# EAGLE board 00A-83 (EAGLE 6.3), part 1 of 2
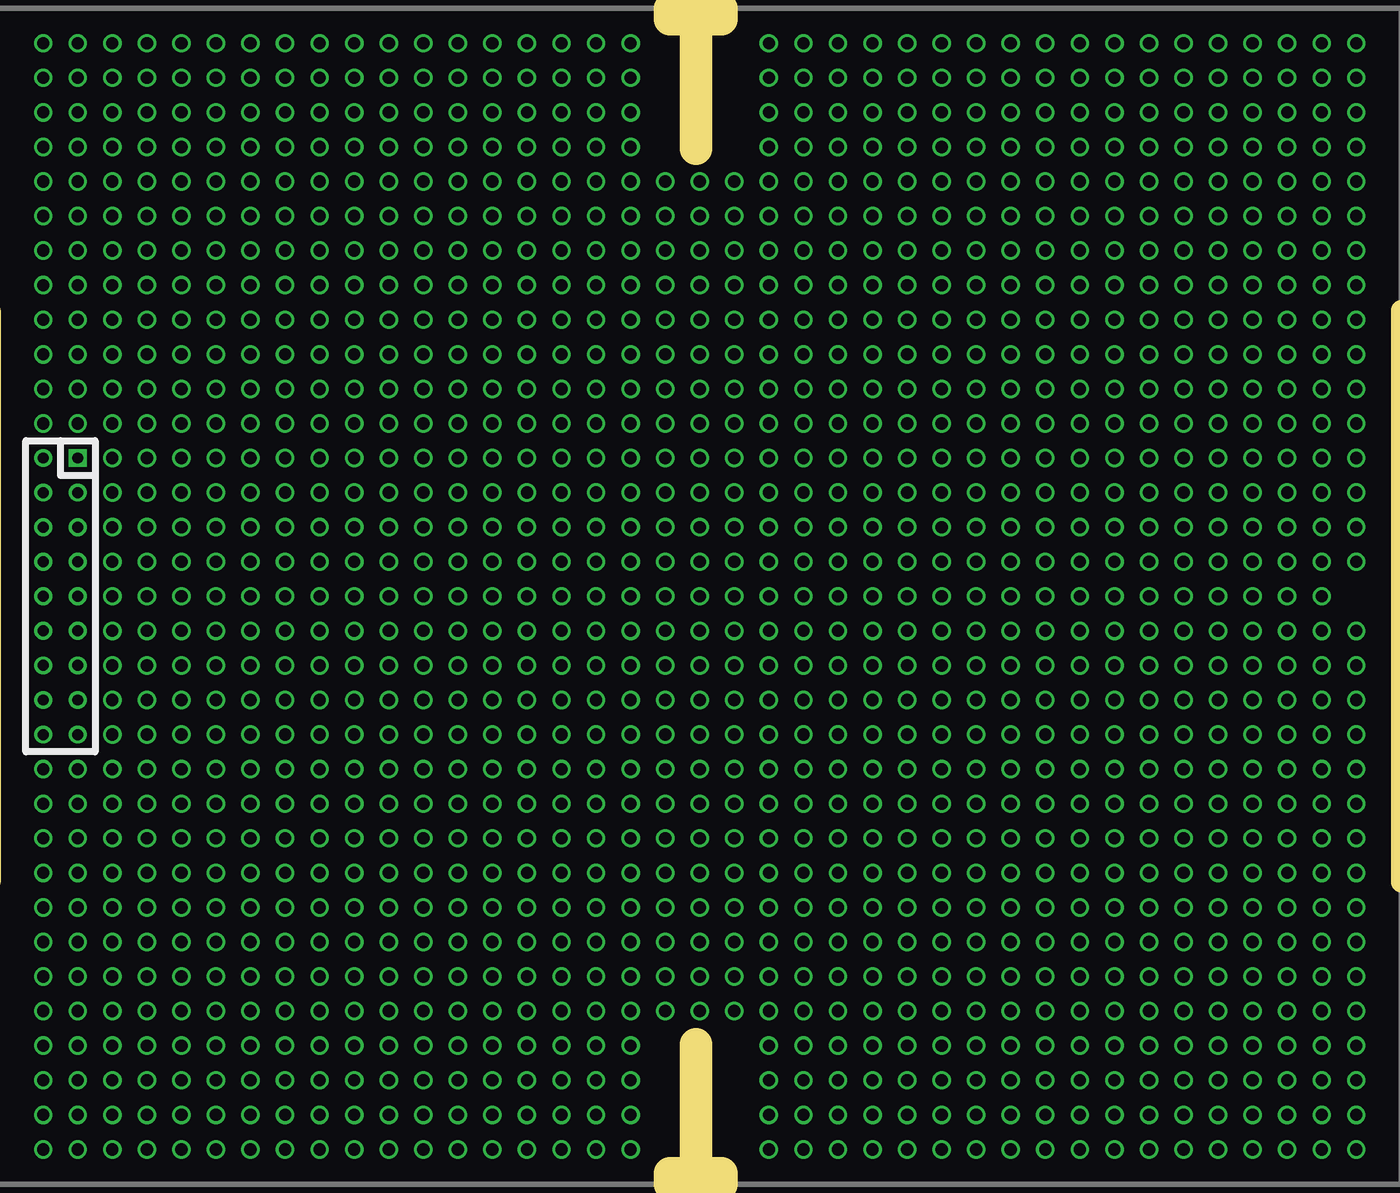
[diagram p1: board, top side]

No outline drawn. Coordinates in mm, seen from the top.
Copper layers (1*16): Top 0.035mm / dielectric 1.5mm / Bottom 0.035mm
Design rules "default": minimum track width 10mil, minimum drill 0.6mm, track to track 8mil, track to pad 8mil, pad to pad 8mil, via to via 8mil, smd to smd 8mil, copper to edge 40mil, drill to drill 8mil, minimum pad ring 10mil, minimum via ring 8mil, stop-mask expansion 4mil, vias tented up to drill 0mil, thermal gap 10mil

## Footprints (pad centres in the part's own frame; a part is rotated, then mirrored left to right if it is on the bottom)
BC_HOUSING_107MM = drill 0.8 square: 1 6.42,10.16 | drill 0.8: 2 3.88,10.16; 3 6.42,7.62; 4 3.88,7.62; 5 6.42,5.08; 6 3.88,5.08; 7 6.42,2.54; 8 3.88,2.54; 9 6.42,0; 10 3.88,0; 11 6.42,-2.54; 12 3.88,-2.54; 13 6.42,-5.08; 14 3.88,-5.08; 15A 6.42,-7.62; 15B 3.88,-7.62; 16A 6.42,-10.16; 16B 3.88,-10.16

## Placement (x,y rotation side)
J1  [BC_HOUSING_107MM]  -3.88,-10.16 0 top

## Tracks (layer width: path | path; a pad name or v marks a point on that pad's centre or on a via)
N$1  (via drill 0.9)
  other vias: 0,2.54
N$2  (via drill 0.9)
  other vias: 2.54,2.54
N$3  (via drill 0.9)
  other vias: 2.54,5.08
N$4  (via drill 0.9)
  other vias: 0,5.08
N$5  (via drill 0.9)
  other vias: 0,7.62
N$6  (via drill 0.9)
  other vias: 2.54,7.62
N$7  (via drill 0.9)
  other vias: 0,10.16
N$8  (via drill 0.9)
  other vias: 2.54,10.16
N$9  (via drill 0.9)
  other vias: 0,12.7
N$10  (via drill 0.9)
  other vias: 2.54,12.7
N$11  (via drill 0.9)
  other vias: 0,15.24
N$12  (via drill 0.9)
  other vias: 2.54,15.24
N$13  (via drill 0.9)
  other vias: 0,17.78
N$14  (via drill 0.9)
  other vias: 2.54,17.78
N$15  (via drill 0.9)
  other vias: 0,20.32
N$16  (via drill 0.9)
  other vias: 2.54,20.32
N$17  (via drill 0.9)
  other vias: 0,22.86
N$18  (via drill 0.9)
  other vias: 2.54,22.86
N$19  (via drill 0.9)
  other vias: 0,25.4
N$20  (via drill 0.9)
  other vias: 2.54,25.4
N$21  (via drill 0.9)
  other vias: 0,27.94
N$22  (via drill 0.9)
  other vias: 2.54,27.94
N$23  (via drill 0.9)
  other vias: 0,30.48
N$24  (via drill 0.9)
  other vias: 2.54,30.48
N$25  (via drill 0.9)
  other vias: 0,-50.8
N$26  (via drill 0.9)
  other vias: 2.54,-50.8
N$27  (via drill 0.9)
  other vias: 2.54,-48.26
N$28  (via drill 0.9)
  other vias: 0,-48.26
N$29  (via drill 0.9)
  other vias: 0,-45.72
N$30  (via drill 0.9)
  other vias: 2.54,-45.72
N$31  (via drill 0.9)
  other vias: 0,-43.18
N$32  (via drill 0.9)
  other vias: 2.54,-43.18
N$33  (via drill 0.9)
  other vias: 0,-40.64
N$34  (via drill 0.9)
  other vias: 2.54,-40.64
N$35  (via drill 0.9)
  other vias: 0,-38.1
N$36  (via drill 0.9)
  other vias: 2.54,-38.1
N$37  (via drill 0.9)
  other vias: 0,-35.56
N$38  (via drill 0.9)
  other vias: 2.54,-35.56
N$39  (via drill 0.9)
  other vias: 0,-33.02
N$40  (via drill 0.9)
  other vias: 2.54,-33.02
N$41  (via drill 0.9)
  other vias: 0,-30.48
N$42  (via drill 0.9)
  other vias: 2.54,-30.48
N$43  (via drill 0.9)
  other vias: 0,-27.94
N$44  (via drill 0.9)
  other vias: 2.54,-27.94
N$45  (via drill 0.9)
  other vias: 0,-25.4
N$46  (via drill 0.9)
  other vias: 2.54,-25.4
N$47  (via drill 0.9)
  other vias: 0,-22.86
N$48  (via drill 0.9)
  other vias: 2.54,-22.86
N$49  (via drill 0.9)
  other vias: 5.08,2.54
N$50  (via drill 0.9)
  other vias: 7.62,2.54
N$51  (via drill 0.9)
  other vias: 7.62,5.08
N$52  (via drill 0.9)
  other vias: 5.08,5.08
N$53  (via drill 0.9)
  other vias: 5.08,7.62
N$54  (via drill 0.9)
  other vias: 7.62,7.62
N$55  (via drill 0.9)
  other vias: 5.08,10.16
N$56  (via drill 0.9)
  other vias: 7.62,10.16
N$57  (via drill 0.9)
  other vias: 5.08,12.7
N$58  (via drill 0.9)
  other vias: 7.62,12.7
N$59  (via drill 0.9)
  other vias: 5.08,15.24
N$60  (via drill 0.9)
  other vias: 7.62,15.24
N$61  (via drill 0.9)
  other vias: 5.08,17.78
N$62  (via drill 0.9)
  other vias: 7.62,17.78
N$63  (via drill 0.9)
  other vias: 5.08,20.32
N$64  (via drill 0.9)
  other vias: 7.62,20.32
N$65  (via drill 0.9)
  other vias: 5.08,22.86
N$66  (via drill 0.9)
  other vias: 7.62,22.86
N$67  (via drill 0.9)
  other vias: 5.08,25.4
N$68  (via drill 0.9)
  other vias: 7.62,25.4
N$69  (via drill 0.9)
  other vias: 5.08,27.94
N$70  (via drill 0.9)
  other vias: 7.62,27.94
N$71  (via drill 0.9)
  other vias: 5.08,30.48
N$72  (via drill 0.9)
  other vias: 7.62,30.48
N$73  (via drill 0.9)
  other vias: 5.08,-27.94
N$74  (via drill 0.9)
  other vias: 7.62,-27.94
N$75  (via drill 0.9)
  other vias: 7.62,-25.4
N$76  (via drill 0.9)
  other vias: 5.08,-25.4
N$77  (via drill 0.9)
  other vias: 5.08,-22.86
N$78  (via drill 0.9)
  other vias: 7.62,-22.86
N$79  (via drill 0.9)
  other vias: 5.08,-20.32
N$80  (via drill 0.9)
  other vias: 7.62,-20.32
N$81  (via drill 0.9)
  other vias: 5.08,-17.78
N$82  (via drill 0.9)
  other vias: 7.62,-17.78
N$83  (via drill 0.9)
  other vias: 5.08,-15.24
N$84  (via drill 0.9)
  other vias: 7.62,-15.24
N$85  (via drill 0.9)
  other vias: 5.08,-12.7
N$86  (via drill 0.9)
  other vias: 7.62,-12.7
N$87  (via drill 0.9)
  other vias: 5.08,-10.16
N$88  (via drill 0.9)
  other vias: 7.62,-10.16
N$89  (via drill 0.9)
  other vias: 5.08,-7.62
N$90  (via drill 0.9)
  other vias: 7.62,-7.62
N$91  (via drill 0.9)
  other vias: 5.08,-5.08
N$92  (via drill 0.9)
  other vias: 7.62,-5.08
N$93  (via drill 0.9)
  other vias: 5.08,-2.54
N$94  (via drill 0.9)
  other vias: 7.62,-2.54
N$95  (via drill 0.9)
  other vias: 5.08,0
N$96  (via drill 0.9)
  other vias: 7.62,0
N$97  (via drill 0.9)
  other vias: 45.72,2.54
N$98  (via drill 0.9)
  other vias: 45.72,5.08
N$99  (via drill 0.9)
  other vias: 45.72,7.62
N$100  (via drill 0.9)
  other vias: 45.72,10.16
N$101  (via drill 0.9)
  other vias: 45.72,12.7
N$102  (via drill 0.9)
  other vias: 45.72,15.24
N$103  (via drill 0.9)
  other vias: 5.08,-50.8
N$104  (via drill 0.9)
  other vias: 7.62,-50.8
N$105  (via drill 0.9)
  other vias: 5.08,-48.26
N$106  (via drill 0.9)
  other vias: 7.62,-48.26
N$107  (via drill 0.9)
  other vias: 5.08,-45.72
N$108  (via drill 0.9)
  other vias: 7.62,-45.72
N$109  (via drill 0.9)
  other vias: 5.08,-43.18
N$110  (via drill 0.9)
  other vias: 7.62,-43.18
N$111  (via drill 0.9)
  other vias: 5.08,-40.64
N$112  (via drill 0.9)
  other vias: 7.62,-40.64
N$113  (via drill 0.9)
  other vias: 5.08,-38.1
N$114  (via drill 0.9)
  other vias: 7.62,-38.1
N$115  (via drill 0.9)
  other vias: 5.08,-35.56
N$116  (via drill 0.9)
  other vias: 7.62,-35.56
N$117  (via drill 0.9)
  other vias: 5.08,-33.02
N$118  (via drill 0.9)
  other vias: 7.62,-33.02
N$119  (via drill 0.9)
  other vias: 5.08,-30.48
N$120  (via drill 0.9)
  other vias: 7.62,-30.48
N$121  (via drill 0.9)
  other vias: 10.16,2.54
N$122  (via drill 0.9)
  other vias: 12.7,2.54
N$123  (via drill 0.9)
  other vias: 12.7,5.08
N$124  (via drill 0.9)
  other vias: 10.16,5.08
N$125  (via drill 0.9)
  other vias: 10.16,7.62
N$126  (via drill 0.9)
  other vias: 12.7,7.62
N$127  (via drill 0.9)
  other vias: 10.16,10.16
N$128  (via drill 0.9)
  other vias: 12.7,10.16
N$129  (via drill 0.9)
  other vias: 10.16,12.7
N$130  (via drill 0.9)
  other vias: 12.7,12.7
N$131  (via drill 0.9)
  other vias: 10.16,15.24
N$132  (via drill 0.9)
  other vias: 12.7,15.24
N$133  (via drill 0.9)
  other vias: 10.16,17.78
N$134  (via drill 0.9)
  other vias: 12.7,17.78
N$135  (via drill 0.9)
  other vias: 10.16,20.32
N$136  (via drill 0.9)
  other vias: 12.7,20.32
N$137  (via drill 0.9)
  other vias: 10.16,22.86
N$138  (via drill 0.9)
  other vias: 12.7,22.86
N$139  (via drill 0.9)
  other vias: 10.16,25.4
N$140  (via drill 0.9)
  other vias: 12.7,25.4
N$141  (via drill 0.9)
  other vias: 10.16,27.94
N$142  (via drill 0.9)
  other vias: 12.7,27.94
N$143  (via drill 0.9)
  other vias: 10.16,30.48
N$144  (via drill 0.9)
  other vias: 12.7,30.48
N$145  (via drill 0.9)
  other vias: 10.16,-27.94
N$146  (via drill 0.9)
  other vias: 12.7,-27.94
N$147  (via drill 0.9)
  other vias: 12.7,-25.4
N$148  (via drill 0.9)
  other vias: 10.16,-25.4
N$149  (via drill 0.9)
  other vias: 10.16,-22.86
N$150  (via drill 0.9)
  other vias: 12.7,-22.86
N$151  (via drill 0.9)
  other vias: 10.16,-20.32
N$152  (via drill 0.9)
  other vias: 12.7,-20.32
N$153  (via drill 0.9)
  other vias: 10.16,-17.78
N$154  (via drill 0.9)
  other vias: 12.7,-17.78
N$155  (via drill 0.9)
  other vias: 10.16,-15.24
N$156  (via drill 0.9)
  other vias: 12.7,-15.24
N$157  (via drill 0.9)
  other vias: 10.16,-12.7
N$158  (via drill 0.9)
  other vias: 12.7,-12.7
N$159  (via drill 0.9)
  other vias: 10.16,-10.16
N$160  (via drill 0.9)
  other vias: 12.7,-10.16
N$161  (via drill 0.9)
  other vias: 10.16,-7.62
N$162  (via drill 0.9)
  other vias: 12.7,-7.62
N$163  (via drill 0.9)
  other vias: 10.16,-5.08
N$164  (via drill 0.9)
  other vias: 12.7,-5.08
N$165  (via drill 0.9)
  other vias: 10.16,-2.54
N$166  (via drill 0.9)
  other vias: 12.7,-2.54
N$167  (via drill 0.9)
  other vias: 10.16,0
N$168  (via drill 0.9)
  other vias: 12.7,0
N$169  (via drill 0.9)
  other vias: 10.16,-50.8
N$170  (via drill 0.9)
  other vias: 12.7,-50.8
N$171  (via drill 0.9)
  other vias: 10.16,-48.26
N$172  (via drill 0.9)
  other vias: 12.7,-48.26
N$173  (via drill 0.9)
  other vias: 10.16,-45.72
N$174  (via drill 0.9)
  other vias: 12.7,-45.72
N$175  (via drill 0.9)
  other vias: 10.16,-43.18
N$176  (via drill 0.9)
  other vias: 12.7,-43.18
N$177  (via drill 0.9)
  other vias: 10.16,-40.64
N$178  (via drill 0.9)
  other vias: 12.7,-40.64
N$179  (via drill 0.9)
  other vias: 10.16,-38.1
N$180  (via drill 0.9)
  other vias: 12.7,-38.1
N$181  (via drill 0.9)
  other vias: 10.16,-35.56
N$182  (via drill 0.9)
  other vias: 12.7,-35.56
N$183  (via drill 0.9)
  other vias: 10.16,-33.02
N$184  (via drill 0.9)
  other vias: 12.7,-33.02
N$185  (via drill 0.9)
  other vias: 10.16,-30.48
N$186  (via drill 0.9)
  other vias: 12.7,-30.48
N$187  (via drill 0.9)
  other vias: 15.24,2.54
N$188  (via drill 0.9)
  other vias: 17.78,2.54
N$189  (via drill 0.9)
  other vias: 17.78,5.08
N$190  (via drill 0.9)
  other vias: 15.24,5.08
N$191  (via drill 0.9)
  other vias: 15.24,7.62
N$192  (via drill 0.9)
  other vias: 17.78,7.62
N$193  (via drill 0.9)
  other vias: 15.24,10.16
N$194  (via drill 0.9)
  other vias: 17.78,10.16
N$195  (via drill 0.9)
  other vias: 15.24,12.7
N$196  (via drill 0.9)
  other vias: 17.78,12.7
N$197  (via drill 0.9)
  other vias: 15.24,15.24
N$198  (via drill 0.9)
  other vias: 17.78,15.24
N$199  (via drill 0.9)
  other vias: 15.24,17.78
N$200  (via drill 0.9)
  other vias: 17.78,17.78
N$201  (via drill 0.9)
  other vias: 15.24,20.32
N$202  (via drill 0.9)
  other vias: 17.78,20.32
N$203  (via drill 0.9)
  other vias: 15.24,22.86
N$204  (via drill 0.9)
  other vias: 17.78,22.86
N$205  (via drill 0.9)
  other vias: 15.24,25.4
N$206  (via drill 0.9)
  other vias: 17.78,25.4
N$207  (via drill 0.9)
  other vias: 15.24,27.94
N$208  (via drill 0.9)
  other vias: 17.78,27.94
N$209  (via drill 0.9)
  other vias: 15.24,30.48
N$210  (via drill 0.9)
  other vias: 17.78,30.48
N$211  (via drill 0.9)
  other vias: 15.24,-27.94
N$212  (via drill 0.9)
  other vias: 17.78,-27.94
N$213  (via drill 0.9)
  other vias: 17.78,-25.4
N$214  (via drill 0.9)
  other vias: 15.24,-25.4
N$215  (via drill 0.9)
  other vias: 15.24,-22.86
N$216  (via drill 0.9)
  other vias: 17.78,-22.86
N$217  (via drill 0.9)
  other vias: 15.24,-20.32
N$218  (via drill 0.9)
  other vias: 17.78,-20.32
N$219  (via drill 0.9)
  other vias: 15.24,-17.78
N$220  (via drill 0.9)
  other vias: 17.78,-17.78
N$221  (via drill 0.9)
  other vias: 15.24,-15.24
N$222  (via drill 0.9)
  other vias: 17.78,-15.24
N$223  (via drill 0.9)
  other vias: 15.24,-12.7
N$224  (via drill 0.9)
  other vias: 17.78,-12.7
N$225  (via drill 0.9)
  other vias: 15.24,-10.16
N$226  (via drill 0.9)
  other vias: 17.78,-10.16
N$227  (via drill 0.9)
  other vias: 15.24,-7.62
N$228  (via drill 0.9)
  other vias: 17.78,-7.62
N$229  (via drill 0.9)
  other vias: 15.24,-5.08
N$230  (via drill 0.9)
  other vias: 17.78,-5.08
N$231  (via drill 0.9)
  other vias: 15.24,-2.54
N$232  (via drill 0.9)
  other vias: 17.78,-2.54
N$233  (via drill 0.9)
  other vias: 15.24,0
N$234  (via drill 0.9)
  other vias: 17.78,0
N$235  (via drill 0.9)
  other vias: 15.24,-50.8
N$236  (via drill 0.9)
  other vias: 17.78,-50.8
N$237  (via drill 0.9)
  other vias: 15.24,-48.26
N$238  (via drill 0.9)
  other vias: 17.78,-48.26
N$239  (via drill 0.9)
  other vias: 15.24,-45.72
N$240  (via drill 0.9)
  other vias: 17.78,-45.72
N$241  (via drill 0.9)
  other vias: 15.24,-43.18
N$242  (via drill 0.9)
  other vias: 17.78,-43.18
N$243  (via drill 0.9)
  other vias: 15.24,-40.64
N$244  (via drill 0.9)
  other vias: 17.78,-40.64
N$245  (via drill 0.9)
  other vias: 15.24,-38.1
N$246  (via drill 0.9)
  other vias: 17.78,-38.1
N$247  (via drill 0.9)
  other vias: 15.24,-35.56
N$248  (via drill 0.9)
  other vias: 17.78,-35.56
N$249  (via drill 0.9)
  other vias: 15.24,-33.02
N$250  (via drill 0.9)
  other vias: 17.78,-33.02
N$251  (via drill 0.9)
  other vias: 15.24,-30.48
N$252  (via drill 0.9)
  other vias: 17.78,-30.48
N$253  (via drill 0.9)
  other vias: 20.32,2.54
N$254  (via drill 0.9)
  other vias: 22.86,2.54
N$255  (via drill 0.9)
  other vias: 22.86,5.08
N$256  (via drill 0.9)
  other vias: 20.32,5.08
N$257  (via drill 0.9)
  other vias: 20.32,7.62
N$258  (via drill 0.9)
  other vias: 22.86,7.62
N$259  (via drill 0.9)
  other vias: 20.32,10.16
N$260  (via drill 0.9)
  other vias: 22.86,10.16
N$261  (via drill 0.9)
  other vias: 20.32,12.7
N$262  (via drill 0.9)
  other vias: 22.86,12.7
N$263  (via drill 0.9)
  other vias: 20.32,15.24
N$264  (via drill 0.9)
  other vias: 22.86,15.24
N$265  (via drill 0.9)
  other vias: 20.32,17.78
N$266  (via drill 0.9)
  other vias: 22.86,17.78
N$267  (via drill 0.9)
  other vias: 20.32,20.32
N$268  (via drill 0.9)
  other vias: 22.86,20.32
N$269  (via drill 0.9)
  other vias: 20.32,22.86
N$270  (via drill 0.9)
  other vias: 22.86,22.86
N$271  (via drill 0.9)
  other vias: 20.32,25.4
N$272  (via drill 0.9)
  other vias: 22.86,25.4
N$273  (via drill 0.9)
  other vias: 20.32,27.94
N$274  (via drill 0.9)
  other vias: 22.86,27.94
N$275  (via drill 0.9)
  other vias: 20.32,30.48
N$276  (via drill 0.9)
  other vias: 22.86,30.48
N$277  (via drill 0.9)
  other vias: 20.32,-27.94
N$278  (via drill 0.9)
  other vias: 22.86,-27.94
N$279  (via drill 0.9)
  other vias: 22.86,-25.4
N$280  (via drill 0.9)
  other vias: 20.32,-25.4
N$281  (via drill 0.9)
  other vias: 20.32,-22.86
N$282  (via drill 0.9)
  other vias: 22.86,-22.86
N$283  (via drill 0.9)
  other vias: 20.32,-20.32
N$284  (via drill 0.9)
  other vias: 22.86,-20.32
N$285  (via drill 0.9)
  other vias: 20.32,-17.78
N$286  (via drill 0.9)
  other vias: 22.86,-17.78
N$287  (via drill 0.9)
  other vias: 20.32,-15.24
N$288  (via drill 0.9)
  other vias: 22.86,-15.24
N$289  (via drill 0.9)
  other vias: 20.32,-12.7
N$290  (via drill 0.9)
  other vias: 22.86,-12.7
N$291  (via drill 0.9)
  other vias: 20.32,-10.16
N$292  (via drill 0.9)
  other vias: 22.86,-10.16
N$293  (via drill 0.9)
  other vias: 20.32,-7.62
N$294  (via drill 0.9)
  other vias: 22.86,-7.62
N$295  (via drill 0.9)
  other vias: 20.32,-5.08
N$296  (via drill 0.9)
  other vias: 22.86,-5.08
N$297  (via drill 0.9)
  other vias: 20.32,-2.54
N$298  (via drill 0.9)
  other vias: 22.86,-2.54
N$299  (via drill 0.9)
  other vias: 20.32,0
N$300  (via drill 0.9)
  other vias: 22.86,0
N$301  (via drill 0.9)
  other vias: 20.32,-50.8
N$302  (via drill 0.9)
  other vias: 22.86,-50.8
N$303  (via drill 0.9)
  other vias: 20.32,-48.26
N$304  (via drill 0.9)
  other vias: 22.86,-48.26
N$305  (via drill 0.9)
  other vias: 20.32,-45.72
N$306  (via drill 0.9)
  other vias: 22.86,-45.72
N$307  (via drill 0.9)
  other vias: 20.32,-43.18
N$308  (via drill 0.9)
  other vias: 22.86,-43.18
N$309  (via drill 0.9)
  other vias: 20.32,-40.64
N$310  (via drill 0.9)
  other vias: 22.86,-40.64
N$311  (via drill 0.9)
  other vias: 20.32,-38.1
N$312  (via drill 0.9)
  other vias: 22.86,-38.1
N$313  (via drill 0.9)
  other vias: 20.32,-35.56
N$314  (via drill 0.9)
  other vias: 22.86,-35.56
N$315  (via drill 0.9)
  other vias: 20.32,-33.02
N$316  (via drill 0.9)
  other vias: 22.86,-33.02
N$317  (via drill 0.9)
  other vias: 20.32,-30.48
N$318  (via drill 0.9)
  other vias: 22.86,-30.48
N$319  (via drill 0.9)
  other vias: 25.4,2.54
N$320  (via drill 0.9)
  other vias: 27.94,2.54
N$321  (via drill 0.9)
  other vias: 27.94,5.08
N$322  (via drill 0.9)
  other vias: 25.4,5.08
N$323  (via drill 0.9)
  other vias: 25.4,7.62
N$324  (via drill 0.9)
  other vias: 27.94,7.62
N$325  (via drill 0.9)
  other vias: 25.4,10.16
N$326  (via drill 0.9)
  other vias: 27.94,10.16
N$327  (via drill 0.9)
  other vias: 25.4,12.7
N$328  (via drill 0.9)
  other vias: 27.94,12.7
N$329  (via drill 0.9)
  other vias: 25.4,15.24
N$330  (via drill 0.9)
  other vias: 27.94,15.24
N$331  (via drill 0.9)
  other vias: 25.4,17.78
N$332  (via drill 0.9)
  other vias: 27.94,17.78
N$333  (via drill 0.9)
  other vias: 25.4,20.32
N$334  (via drill 0.9)
  other vias: 27.94,20.32
N$335  (via drill 0.9)
  other vias: 25.4,22.86
N$336  (via drill 0.9)
  other vias: 63.5,2.54
N$337  (via drill 0.9)
  other vias: 25.4,25.4
N$338  (via drill 0.9)
  other vias: 66.04,2.54
N$339  (via drill 0.9)
  other vias: 25.4,27.94
N$340  (via drill 0.9)
  other vias: 66.04,5.08
N$341  (via drill 0.9)
  other vias: 25.4,30.48
N$342  (via drill 0.9)
  other vias: 63.5,5.08
N$343  (via drill 0.9)
  other vias: 25.4,-27.94
N$344  (via drill 0.9)
  other vias: 27.94,-27.94
N$345  (via drill 0.9)
  other vias: 27.94,-25.4
N$346  (via drill 0.9)
  other vias: 25.4,-25.4
N$347  (via drill 0.9)
  other vias: 25.4,-22.86
N$348  (via drill 0.9)
  other vias: 27.94,-22.86
N$349  (via drill 0.9)
  other vias: 25.4,-20.32
N$350  (via drill 0.9)
  other vias: 27.94,-20.32
N$351  (via drill 0.9)
  other vias: 25.4,-17.78
N$352  (via drill 0.9)
  other vias: 27.94,-17.78
N$353  (via drill 0.9)
  other vias: 25.4,-15.24
N$354  (via drill 0.9)
  other vias: 27.94,-15.24
N$355  (via drill 0.9)
  other vias: 25.4,-12.7
N$356  (via drill 0.9)
  other vias: 27.94,-12.7
N$357  (via drill 0.9)
  other vias: 25.4,-10.16
N$358  (via drill 0.9)
  other vias: 27.94,-10.16
N$359  (via drill 0.9)
  other vias: 25.4,-7.62
N$360  (via drill 0.9)
  other vias: 27.94,-7.62
N$361  (via drill 0.9)
  other vias: 25.4,-5.08
N$362  (via drill 0.9)
  other vias: 27.94,-5.08
N$363  (via drill 0.9)
  other vias: 25.4,-2.54
N$364  (via drill 0.9)
  other vias: 27.94,-2.54
N$365  (via drill 0.9)
  other vias: 25.4,0
N$366  (via drill 0.9)
  other vias: 27.94,0
N$367  (via drill 0.9)
  other vias: 25.4,-50.8
N$368  (via drill 0.9)
  other vias: 63.5,7.62
N$369  (via drill 0.9)
  other vias: 25.4,-48.26
N$370  (via drill 0.9)
  other vias: 66.04,7.62
N$371  (via drill 0.9)
  other vias: 25.4,-45.72
N$372  (via drill 0.9)
  other vias: 63.5,10.16
N$373  (via drill 0.9)
  other vias: 25.4,-43.18
N$374  (via drill 0.9)
  other vias: 66.04,10.16
N$375  (via drill 0.9)
  other vias: 25.4,-40.64
N$376  (via drill 0.9)
  other vias: 27.94,-40.64
N$377  (via drill 0.9)
  other vias: 25.4,-38.1
N$378  (via drill 0.9)
  other vias: 27.94,-38.1
N$379  (via drill 0.9)
  other vias: 25.4,-35.56
N$380  (via drill 0.9)
  other vias: 27.94,-35.56
N$381  (via drill 0.9)
  other vias: 25.4,-33.02
N$382  (via drill 0.9)
  other vias: 27.94,-33.02
N$383  (via drill 0.9)
  other vias: 25.4,-30.48
N$384  (via drill 0.9)
  other vias: 27.94,-30.48
N$385  (via drill 0.9)
  other vias: 30.48,2.54
N$386  (via drill 0.9)
  other vias: 33.02,2.54
N$387  (via drill 0.9)
  other vias: 33.02,5.08
N$388  (via drill 0.9)
  other vias: 30.48,5.08
N$389  (via drill 0.9)
  other vias: 30.48,7.62
N$390  (via drill 0.9)
  other vias: 33.02,7.62
N$391  (via drill 0.9)
  other vias: 30.48,10.16
N$392  (via drill 0.9)
  other vias: 33.02,10.16
N$393  (via drill 0.9)
  other vias: 30.48,12.7
N$394  (via drill 0.9)
  other vias: 33.02,12.7
N$395  (via drill 0.9)
  other vias: 30.48,15.24
N$396  (via drill 0.9)
  other vias: 33.02,15.24
N$397  (via drill 0.9)
  other vias: 30.48,17.78
N$398  (via drill 0.9)
  other vias: 33.02,17.78
N$399  (via drill 0.9)
  other vias: 30.48,20.32
N$400  (via drill 0.9)
  other vias: 33.02,20.32
N$401  (via drill 0.9)
  other vias: 63.5,12.7
N$402  (via drill 0.9)
  other vias: 66.04,12.7
N$403  (via drill 0.9)
  other vias: 63.5,15.24
N$404  (via drill 0.9)
  other vias: 66.04,15.24
N$405  (via drill 0.9)
  other vias: 63.5,17.78
N$406  (via drill 0.9)
  other vias: 66.04,17.78
N$407  (via drill 0.9)
  other vias: 63.5,20.32
N$408  (via drill 0.9)
  other vias: 66.04,20.32
N$409  (via drill 0.9)
  other vias: 30.48,-27.94
N$410  (via drill 0.9)
  other vias: 33.02,-27.94
N$411  (via drill 0.9)
  other vias: 33.02,-25.4
N$412  (via drill 0.9)
  other vias: 30.48,-25.4
N$413  (via drill 0.9)
  other vias: 30.48,-22.86
N$414  (via drill 0.9)
  other vias: 33.02,-22.86
N$415  (via drill 0.9)
  other vias: 30.48,-20.32
N$416  (via drill 0.9)
  other vias: 33.02,-20.32
N$417  (via drill 0.9)
  other vias: 30.48,-17.78
N$418  (via drill 0.9)
  other vias: 33.02,-17.78
N$419  (via drill 0.9)
  other vias: 30.48,-15.24
N$420  (via drill 0.9)
  other vias: 33.02,-15.24
N$421  (via drill 0.9)
  other vias: 30.48,-12.7
N$422  (via drill 0.9)
  other vias: 33.02,-12.7
N$423  (via drill 0.9)
  other vias: 30.48,-10.16
N$424  (via drill 0.9)
  other vias: 33.02,-10.16
N$425  (via drill 0.9)
  other vias: 30.48,-7.62
N$426  (via drill 0.9)
  other vias: 33.02,-7.62
N$427  (via drill 0.9)
  other vias: 30.48,-5.08
N$428  (via drill 0.9)
  other vias: 33.02,-5.08
N$429  (via drill 0.9)
  other vias: 30.48,-2.54
N$430  (via drill 0.9)
  other vias: 33.02,-2.54
N$431  (via drill 0.9)
  other vias: 30.48,0
N$432  (via drill 0.9)
  other vias: 33.02,0
N$433  (via drill 0.9)
  other vias: 63.5,22.86
N$434  (via drill 0.9)
  other vias: 66.04,22.86
N$435  (via drill 0.9)
  other vias: 63.5,25.4
N$436  (via drill 0.9)
  other vias: 66.04,25.4
N$437  (via drill 0.9)
  other vias: 63.5,27.94
N$438  (via drill 0.9)
  other vias: 66.04,27.94
N$439  (via drill 0.9)
  other vias: 63.5,30.48
N$440  (via drill 0.9)
  other vias: 66.04,30.48
N$441  (via drill 0.9)
  other vias: 30.48,-40.64
N$442  (via drill 0.9)
  other vias: 33.02,-40.64
N$443  (via drill 0.9)
  other vias: 30.48,-38.1
N$444  (via drill 0.9)
  other vias: 33.02,-38.1
N$445  (via drill 0.9)
  other vias: 30.48,-35.56
N$446  (via drill 0.9)
  other vias: 33.02,-35.56
N$447  (via drill 0.9)
  other vias: 30.48,-33.02
N$448  (via drill 0.9)
  other vias: 33.02,-33.02
N$449  (via drill 0.9)
  other vias: 30.48,-30.48
N$450  (via drill 0.9)
  other vias: 33.02,-30.48
N$451  (via drill 0.9)
  other vias: 35.56,2.54
N$452  (via drill 0.9)
  other vias: 38.1,2.54
N$453  (via drill 0.9)
  other vias: 38.1,5.08
N$454  (via drill 0.9)
  other vias: 35.56,5.08
N$455  (via drill 0.9)
  other vias: 35.56,7.62
N$456  (via drill 0.9)
  other vias: 38.1,7.62
N$457  (via drill 0.9)
  other vias: 35.56,10.16
N$458  (via drill 0.9)
  other vias: 38.1,10.16
N$459  (via drill 0.9)
  other vias: 35.56,12.7
N$460  (via drill 0.9)
  other vias: 38.1,12.7
N$461  (via drill 0.9)
  other vias: 35.56,15.24
N$462  (via drill 0.9)
  other vias: 38.1,15.24
N$463  (via drill 0.9)
  other vias: 35.56,17.78
N$464  (via drill 0.9)
  other vias: 38.1,17.78
N$465  (via drill 0.9)
  other vias: 35.56,20.32
N$466  (via drill 0.9)
  other vias: 38.1,20.32
N$467  (via drill 0.9)
  other vias: 35.56,22.86
N$468  (via drill 0.9)
  other vias: 38.1,22.86
N$469  (via drill 0.9)
  other vias: 35.56,25.4
N$470  (via drill 0.9)
  other vias: 38.1,25.4
N$471  (via drill 0.9)
  other vias: 35.56,27.94
N$472  (via drill 0.9)
  other vias: 38.1,27.94
N$473  (via drill 0.9)
  other vias: 35.56,30.48
N$474  (via drill 0.9)
  other vias: 38.1,30.48
N$475  (via drill 0.9)
  other vias: 35.56,-27.94
N$476  (via drill 0.9)
  other vias: 38.1,-27.94
N$477  (via drill 0.9)
  other vias: 38.1,-25.4
N$478  (via drill 0.9)
  other vias: 35.56,-25.4
N$479  (via drill 0.9)
  other vias: 35.56,-22.86
N$480  (via drill 0.9)
  other vias: 38.1,-22.86
N$481  (via drill 0.9)
  other vias: 35.56,-20.32
N$482  (via drill 0.9)
  other vias: 38.1,-20.32
N$483  (via drill 0.9)
  other vias: 35.56,-17.78
N$484  (via drill 0.9)
  other vias: 38.1,-17.78
N$485  (via drill 0.9)
  other vias: 35.56,-15.24
N$486  (via drill 0.9)
  other vias: 38.1,-15.24
N$487  (via drill 0.9)
  other vias: 35.56,-12.7
N$488  (via drill 0.9)
  other vias: 38.1,-12.7
N$489  (via drill 0.9)
  other vias: 35.56,-10.16
N$490  (via drill 0.9)
  other vias: 38.1,-10.16
N$491  (via drill 0.9)
  other vias: 35.56,-7.62
N$492  (via drill 0.9)
  other vias: 38.1,-7.62
N$493  (via drill 0.9)
  other vias: 35.56,-5.08
N$494  (via drill 0.9)
  other vias: 38.1,-5.08
N$495  (via drill 0.9)
  other vias: 35.56,-2.54
N$496  (via drill 0.9)
  other vias: 38.1,-2.54
N$497  (via drill 0.9)
  other vias: 35.56,0
N$498  (via drill 0.9)
  other vias: 38.1,0
N$499  (via drill 0.9)
  other vias: 35.56,-50.8
N$500  (via drill 0.9)
  other vias: 38.1,-50.8
N$501  (via drill 0.9)
  other vias: 35.56,-48.26
N$502  (via drill 0.9)
  other vias: 38.1,-48.26
N$503  (via drill 0.9)
  other vias: 35.56,-45.72
N$504  (via drill 0.9)
  other vias: 38.1,-45.72
N$505  (via drill 0.9)
  other vias: 35.56,-43.18
N$506  (via drill 0.9)
  other vias: 38.1,-43.18
N$507  (via drill 0.9)
  other vias: 35.56,-40.64
N$508  (via drill 0.9)
  other vias: 38.1,-40.64
N$509  (via drill 0.9)
  other vias: 35.56,-38.1
N$510  (via drill 0.9)
  other vias: 38.1,-38.1
N$511  (via drill 0.9)
  other vias: 35.56,-35.56
N$512  (via drill 0.9)
  other vias: 38.1,-35.56
N$513  (via drill 0.9)
  other vias: 35.56,-33.02
N$514  (via drill 0.9)
  other vias: 38.1,-33.02
N$515  (via drill 0.9)
  other vias: 35.56,-30.48
N$516  (via drill 0.9)
  other vias: 38.1,-30.48
N$517  (via drill 0.9)
  other vias: 40.64,2.54
N$518  (via drill 0.9)
  other vias: 43.18,2.54
N$519  (via drill 0.9)
  other vias: 43.18,5.08
N$520  (via drill 0.9)
  other vias: 40.64,5.08
N$521  (via drill 0.9)
  other vias: 40.64,7.62
N$522  (via drill 0.9)
  other vias: 43.18,7.62
N$523  (via drill 0.9)
  other vias: 40.64,10.16
N$524  (via drill 0.9)
  other vias: 43.18,10.16
N$525  (via drill 0.9)
  other vias: 40.64,12.7
N$526  (via drill 0.9)
  other vias: 43.18,12.7
N$527  (via drill 0.9)
  other vias: 40.64,15.24
N$528  (via drill 0.9)
  other vias: 43.18,15.24
N$529  (via drill 0.9)
  other vias: 40.64,17.78
N$530  (via drill 0.9)
  other vias: 43.18,17.78
N$531  (via drill 0.9)
  other vias: 40.64,20.32
N$532  (via drill 0.9)
  other vias: 43.18,20.32
N$533  (via drill 0.9)
  other vias: 40.64,22.86
N$534  (via drill 0.9)
  other vias: 43.18,22.86
N$535  (via drill 0.9)
  other vias: 40.64,25.4
N$536  (via drill 0.9)
  other vias: 43.18,25.4
N$537  (via drill 0.9)
  other vias: 40.64,27.94
N$538  (via drill 0.9)
  other vias: 43.18,27.94
N$539  (via drill 0.9)
  other vias: 40.64,30.48
N$540  (via drill 0.9)
  other vias: 43.18,30.48
N$541  (via drill 0.9)
  other vias: 40.64,-27.94
N$542  (via drill 0.9)
  other vias: 43.18,-27.94
N$543  (via drill 0.9)
  other vias: 43.18,-25.4
N$544  (via drill 0.9)
  other vias: 40.64,-25.4
N$545  (via drill 0.9)
  other vias: 40.64,-22.86
N$546  (via drill 0.9)
  other vias: 43.18,-22.86
N$547  (via drill 0.9)
  other vias: 40.64,-20.32
N$548  (via drill 0.9)
  other vias: 43.18,-20.32
N$549  (via drill 0.9)
  other vias: 40.64,-17.78
N$550  (via drill 0.9)
  other vias: 43.18,-17.78
N$551  (via drill 0.9)
  other vias: 40.64,-15.24
N$552  (via drill 0.9)
  other vias: 43.18,-15.24
N$553  (via drill 0.9)
  other vias: 40.64,-12.7
N$554  (via drill 0.9)
  other vias: 43.18,-12.7
N$555  (via drill 0.9)
  other vias: 40.64,-10.16 43.18,-10.16
N$556  (via drill 0.9)
  other vias: 45.72,17.78
N$557  (via drill 0.9)
  other vias: 40.64,-7.62
N$558  (via drill 0.9)
  other vias: 43.18,-7.62
N$559  (via drill 0.9)
  other vias: 40.64,-5.08
N$560  (via drill 0.9)
  other vias: 43.18,-5.08
N$561  (via drill 0.9)
  other vias: 40.64,-2.54
N$562  (via drill 0.9)
  other vias: 43.18,-2.54
N$563  (via drill 0.9)
  other vias: 40.64,0
N$564  (via drill 0.9)
  other vias: 43.18,0
N$565  (via drill 0.9)
  other vias: 40.64,-50.8
N$566  (via drill 0.9)
  other vias: 43.18,-50.8
N$567  (via drill 0.9)
  other vias: 40.64,-48.26
N$568  (via drill 0.9)
  other vias: 43.18,-48.26
N$569  (via drill 0.9)
  other vias: 40.64,-45.72
N$570  (via drill 0.9)
  other vias: 43.18,-45.72
N$571  (via drill 0.9)
  other vias: 40.64,-43.18
N$572  (via drill 0.9)
  other vias: 43.18,-43.18
N$573  (via drill 0.9)
  other vias: 40.64,-40.64
N$574  (via drill 0.9)
  other vias: 43.18,-40.64
N$575  (via drill 0.9)
  other vias: 40.64,-38.1
N$576  (via drill 0.9)
  other vias: 43.18,-38.1
N$577  (via drill 0.9)
  other vias: 40.64,-35.56
N$578  (via drill 0.9)
  other vias: 43.18,-35.56
N$579  (via drill 0.9)
  other vias: 40.64,-33.02
N$580  (via drill 0.9)
  other vias: 43.18,-33.02
N$581  (via drill 0.9)
  other vias: 40.64,-30.48
N$582  (via drill 0.9)
  other vias: 43.18,-30.48
N$583  (via drill 0.9)
  other vias: 45.72,20.32
N$588  (via drill 0.9)
  other vias: 45.72,-27.94
N$589  (via drill 0.9)
  other vias: 45.72,-25.4
N$590  (via drill 0.9)
  other vias: 45.72,-22.86
N$591  (via drill 0.9)
  other vias: 45.72,-20.32
N$592  (via drill 0.9)
  other vias: 45.72,-17.78
N$593  (via drill 0.9)
  other vias: 45.72,-15.24
N$594  (via drill 0.9)
  other vias: 45.72,-12.7
N$595  (via drill 0.9)
  other vias: 45.72,-10.16
N$596  (via drill 0.9)
  other vias: 45.72,-7.62
N$597  (via drill 0.9)
  other vias: 45.72,-5.08
N$598  (via drill 0.9)
  other vias: 45.72,-2.54
N$599  (via drill 0.9)
  other vias: 45.72,0
N$604  (via drill 0.9)
  other vias: 45.72,-40.64
N$605  (via drill 0.9)
  other vias: 45.72,-38.1
N$606  (via drill 0.9)
  other vias: 45.72,-35.56
N$607  (via drill 0.9)
  other vias: 45.72,-33.02
N$608  (via drill 0.9)
  other vias: 45.72,-30.48
N$609  (via drill 0.9)
  other vias: 48.26,2.54
N$610  (via drill 0.9)
  other vias: 50.8,2.54
N$611  (via drill 0.9)
  other vias: 50.8,5.08
N$612  (via drill 0.9)
  other vias: 48.26,5.08
N$613  (via drill 0.9)
  other vias: 48.26,7.62
N$614  (via drill 0.9)
  other vias: 50.8,7.62
N$615  (via drill 0.9)
  other vias: 48.26,10.16
N$616  (via drill 0.9)
  other vias: 50.8,10.16
N$617  (via drill 0.9)
  other vias: 48.26,12.7
N$618  (via drill 0.9)
  other vias: 50.8,12.7
N$619  (via drill 0.9)
  other vias: 48.26,15.24
N$620  (via drill 0.9)
  other vias: 50.8,15.24
N$621  (via drill 0.9)
  other vias: 48.26,17.78
N$622  (via drill 0.9)
  other vias: 50.8,17.78
N$623  (via drill 0.9)
  other vias: 48.26,20.32
N$624  (via drill 0.9)
  other vias: 50.8,20.32
N$633  (via drill 0.9)
  other vias: 48.26,-27.94
N$634  (via drill 0.9)
  other vias: 50.8,-27.94
N$635  (via drill 0.9)
  other vias: 50.8,-25.4
N$636  (via drill 0.9)
  other vias: 48.26,-25.4
N$637  (via drill 0.9)
  other vias: 48.26,-22.86
N$638  (via drill 0.9)
  other vias: 50.8,-22.86
N$639  (via drill 0.9)
  other vias: 48.26,-20.32
N$640  (via drill 0.9)
  other vias: 50.8,-20.32
N$641  (via drill 0.9)
  other vias: 48.26,-17.78
N$642  (via drill 0.9)
  other vias: 50.8,-17.78
N$643  (via drill 0.9)
  other vias: 48.26,-15.24
N$644  (via drill 0.9)
  other vias: 50.8,-15.24
N$645  (via drill 0.9)
  other vias: 48.26,-12.7
N$646  (via drill 0.9)
  other vias: 50.8,-12.7
N$647  (via drill 0.9)
  other vias: 48.26,-10.16
N$648  (via drill 0.9)
  other vias: 50.8,-10.16
N$649  (via drill 0.9)
  other vias: 48.26,-7.62
N$650  (via drill 0.9)
  other vias: 50.8,-7.62
N$651  (via drill 0.9)
  other vias: 48.26,-5.08
N$652  (via drill 0.9)
  other vias: 50.8,-5.08
N$653  (via drill 0.9)
  other vias: 48.26,-2.54
N$654  (via drill 0.9)
  other vias: 50.8,-2.54
N$655  (via drill 0.9)
  other vias: 48.26,0
N$656  (via drill 0.9)
  other vias: 50.8,0
N$665  (via drill 0.9)
  other vias: 48.26,-40.64
N$666  (via drill 0.9)
  other vias: 50.8,-40.64
N$667  (via drill 0.9)
  other vias: 48.26,-38.1
N$668  (via drill 0.9)
  other vias: 50.8,-38.1
N$669  (via drill 0.9)
  other vias: 48.26,-35.56
N$670  (via drill 0.9)
  other vias: 50.8,-35.56
N$671  (via drill 0.9)
  other vias: 48.26,-33.02
N$672  (via drill 0.9)
  other vias: 50.8,-33.02
N$673  (via drill 0.9)
  other vias: 48.26,-30.48
N$674  (via drill 0.9)
  other vias: 50.8,-30.48
N$675  (via drill 0.9)
  other vias: 53.34,2.54
N$676  (via drill 0.9)
  other vias: 55.88,2.54
N$677  (via drill 0.9)
  other vias: 55.88,5.08
N$678  (via drill 0.9)
  other vias: 53.34,5.08
N$679  (via drill 0.9)
  other vias: 53.34,7.62
N$680  (via drill 0.9)
  other vias: 55.88,7.62
N$681  (via drill 0.9)
  other vias: 53.34,10.16
N$682  (via drill 0.9)
  other vias: 55.88,10.16
N$683  (via drill 0.9)
  other vias: 53.34,12.7
N$684  (via drill 0.9)
  other vias: 55.88,12.7
N$685  (via drill 0.9)
  other vias: 53.34,15.24
N$686  (via drill 0.9)
  other vias: 55.88,15.24
N$687  (via drill 0.9)
  other vias: 53.34,17.78
N$688  (via drill 0.9)
  other vias: 55.88,17.78
N$689  (via drill 0.9)
  other vias: 53.34,20.32
N$690  (via drill 0.9)
  other vias: 55.88,20.32
N$691  (via drill 0.9)
  other vias: 53.34,22.86
N$692  (via drill 0.9)
  other vias: 55.88,22.86
N$693  (via drill 0.9)
  other vias: 53.34,25.4
N$694  (via drill 0.9)
  other vias: 55.88,25.4
N$695  (via drill 0.9)
  other vias: 53.34,27.94
N$696  (via drill 0.9)
  other vias: 55.88,27.94
N$697  (via drill 0.9)
  other vias: 53.34,30.48
N$698  (via drill 0.9)
  other vias: 55.88,30.48
N$699  (via drill 0.9)
  other vias: 53.34,-27.94
N$700  (via drill 0.9)
  other vias: 55.88,-27.94
N$701  (via drill 0.9)
  other vias: 55.88,-25.4
N$702  (via drill 0.9)
  other vias: 53.34,-25.4
N$703  (via drill 0.9)
  other vias: 53.34,-22.86
N$704  (via drill 0.9)
  other vias: 55.88,-22.86
N$705  (via drill 0.9)
  other vias: 53.34,-20.32
N$706  (via drill 0.9)
  other vias: 55.88,-20.32
N$707  (via drill 0.9)
  other vias: 53.34,-17.78
N$708  (via drill 0.9)
  other vias: 55.88,-17.78
N$709  (via drill 0.9)
  other vias: 53.34,-15.24
N$710  (via drill 0.9)
  other vias: 55.88,-15.24
N$711  (via drill 0.9)
  other vias: 53.34,-12.7
N$712  (via drill 0.9)
  other vias: 55.88,-12.7
N$713  (via drill 0.9)
  other vias: 53.34,-10.16 55.88,-10.16
N$714  (via drill 0.9)
  other vias: 53.34,-7.62
N$715  (via drill 0.9)
  other vias: 55.88,-7.62
N$716  (via drill 0.9)
  other vias: 53.34,-5.08
N$717  (via drill 0.9)
  other vias: 55.88,-5.08
N$718  (via drill 0.9)
  other vias: 53.34,-2.54
N$719  (via drill 0.9)
  other vias: 55.88,-2.54
N$720  (via drill 0.9)
  other vias: 53.34,0
N$721  (via drill 0.9)
  other vias: 55.88,0
N$722  (via drill 0.9)
  other vias: 53.34,-50.8
N$723  (via drill 0.9)
  other vias: 55.88,-50.8
N$724  (via drill 0.9)
  other vias: 53.34,-48.26
N$725  (via drill 0.9)
  other vias: 55.88,-48.26
N$726  (via drill 0.9)
  other vias: 53.34,-45.72
N$727  (via drill 0.9)
  other vias: 55.88,-45.72
N$728  (via drill 0.9)
  other vias: 53.34,-43.18
N$729  (via drill 0.9)
  other vias: 55.88,-43.18
N$730  (via drill 0.9)
  other vias: 53.34,-40.64
N$731  (via drill 0.9)
  other vias: 55.88,-40.64
N$732  (via drill 0.9)
  other vias: 53.34,-38.1
N$733  (via drill 0.9)
  other vias: 55.88,-38.1
N$734  (via drill 0.9)
  other vias: 53.34,-35.56
N$735  (via drill 0.9)
  other vias: 55.88,-35.56
N$736  (via drill 0.9)
  other vias: 53.34,-33.02
N$737  (via drill 0.9)
  other vias: 55.88,-33.02
N$738  (via drill 0.9)
  other vias: 53.34,-30.48
N$739  (via drill 0.9)
  other vias: 55.88,-30.48
N$740  (via drill 0.9)
  other vias: 58.42,2.54
N$741  (via drill 0.9)
  other vias: 60.96,2.54
N$742  (via drill 0.9)
  other vias: 60.96,5.08
N$743  (via drill 0.9)
  other vias: 58.42,5.08
N$744  (via drill 0.9)
  other vias: 58.42,7.62
N$745  (via drill 0.9)
  other vias: 60.96,7.62
N$746  (via drill 0.9)
  other vias: 58.42,10.16
N$747  (via drill 0.9)
  other vias: 60.96,10.16
N$748  (via drill 0.9)
  other vias: 58.42,12.7
N$749  (via drill 0.9)
  other vias: 60.96,12.7
N$750  (via drill 0.9)
  other vias: 58.42,15.24
N$751  (via drill 0.9)
  other vias: 60.96,15.24
N$752  (via drill 0.9)
  other vias: 58.42,17.78
N$753  (via drill 0.9)
  other vias: 60.96,17.78
N$754  (via drill 0.9)
  other vias: 58.42,20.32
N$755  (via drill 0.9)
  other vias: 60.96,20.32
N$756  (via drill 0.9)
  other vias: 58.42,22.86
N$757  (via drill 0.9)
  other vias: 60.96,22.86
N$758  (via drill 0.9)
  other vias: 58.42,25.4
N$759  (via drill 0.9)
  other vias: 60.96,25.4
N$760  (via drill 0.9)
  other vias: 58.42,27.94
N$761  (via drill 0.9)
  other vias: 60.96,27.94
N$762  (via drill 0.9)
  other vias: 58.42,30.48
N$763  (via drill 0.9)
  other vias: 60.96,30.48
N$764  (via drill 0.9)
  other vias: 58.42,-27.94
N$765  (via drill 0.9)
  other vias: 60.96,-27.94
N$766  (via drill 0.9)
  other vias: 60.96,-25.4
N$767  (via drill 0.9)
  other vias: 58.42,-25.4
N$768  (via drill 0.9)
  other vias: 58.42,-22.86
N$769  (via drill 0.9)
  other vias: 60.96,-22.86
N$770  (via drill 0.9)
  other vias: 58.42,-20.32
N$771  (via drill 0.9)
  other vias: 60.96,-20.32
N$772  (via drill 0.9)
  other vias: 58.42,-17.78
N$773  (via drill 0.9)
  other vias: 60.96,-17.78
N$774  (via drill 0.9)
  other vias: 58.42,-15.24
N$775  (via drill 0.9)
  other vias: 60.96,-15.24
N$776  (via drill 0.9)
  other vias: 58.42,-12.7
N$777  (via drill 0.9)
  other vias: 60.96,-12.7
N$778  (via drill 0.9)
  other vias: 58.42,-10.16
N$779  (via drill 0.9)
  other vias: 58.42,-7.62
N$780  (via drill 0.9)
  other vias: 60.96,-7.62 60.96,-10.16
N$781  (via drill 0.9)
  other vias: 58.42,-5.08
N$782  (via drill 0.9)
  other vias: 60.96,-5.08
N$783  (via drill 0.9)
  other vias: 58.42,-2.54
N$784  (via drill 0.9)
  other vias: 60.96,-2.54
N$785  (via drill 0.9)
  other vias: 58.42,0
N$786  (via drill 0.9)
  other vias: 60.96,0
N$787  (via drill 0.9)
  other vias: 58.42,-50.8
N$788  (via drill 0.9)
  other vias: 60.96,-50.8
N$789  (via drill 0.9)
  other vias: 58.42,-48.26
N$790  (via drill 0.9)
  other vias: 60.96,-48.26
N$791  (via drill 0.9)
  other vias: 58.42,-45.72
N$792  (via drill 0.9)
  other vias: 60.96,-45.72
N$793  (via drill 0.9)
  other vias: 58.42,-43.18
N$794  (via drill 0.9)
  other vias: 60.96,-43.18
N$795  (via drill 0.9)
  other vias: 58.42,-40.64
N$796  (via drill 0.9)
  other vias: 60.96,-40.64
N$797  (via drill 0.9)
  other vias: 58.42,-38.1
N$798  (via drill 0.9)
  other vias: 60.96,-38.1
N$799  (via drill 0.9)
  other vias: 58.42,-35.56
N$800  (via drill 0.9)
  other vias: 60.96,-35.56
N$801  (via drill 0.9)
  other vias: 58.42,-33.02
N$802  (via drill 0.9)
  other vias: 60.96,-33.02
N$803  (via drill 0.9)
  other vias: 58.42,-30.48
N$804  (via drill 0.9)
  other vias: 60.96,-30.48
N$805  (via drill 0.9)
  other vias: 63.5,-27.94
N$806  (via drill 0.9)
  other vias: 66.04,-27.94
N$807  (via drill 0.9)
  other vias: 66.04,-25.4
N$808  (via drill 0.9)
  other vias: 63.5,-25.4
N$809  (via drill 0.9)
  other vias: 63.5,-22.86
N$810  (via drill 0.9)
  other vias: 66.04,-22.86
N$811  (via drill 0.9)
  other vias: 63.5,-20.32
N$812  (via drill 0.9)
  other vias: 66.04,-20.32
N$813  (via drill 0.9)
  other vias: 63.5,-17.78
N$814  (via drill 0.9)
  other vias: 66.04,-17.78
N$815  (via drill 0.9)
  other vias: 63.5,-15.24
N$816  (via drill 0.9)
  other vias: 66.04,-15.24
N$817  (via drill 0.9)
  other vias: 63.5,-12.7
N$818  (via drill 0.9)
  other vias: 66.04,-12.7
N$819  (via drill 0.9)
  other vias: 63.5,-10.16
N$820  (via drill 0.9)
  other vias: 66.04,-10.16
N$821  (via drill 0.9)
  other vias: 63.5,-7.62
N$822  (via drill 0.9)
  other vias: 66.04,-7.62
N$823  (via drill 0.9)
  other vias: 63.5,-5.08
N$824  (via drill 0.9)
  other vias: 66.04,-5.08
N$825  (via drill 0.9)
  other vias: 63.5,-2.54
N$826  (via drill 0.9)
  other vias: 66.04,-2.54
N$827  (via drill 0.9)
  other vias: 63.5,0
N$828  (via drill 0.9)
  other vias: 66.04,0
N$829  (via drill 0.9)
  other vias: 63.5,-50.8
N$830  (via drill 0.9)
  other vias: 66.04,-50.8
N$831  (via drill 0.9)
  other vias: 63.5,-48.26
N$832  (via drill 0.9)
  other vias: 66.04,-48.26
N$833  (via drill 0.9)
  other vias: 63.5,-45.72
N$834  (via drill 0.9)
  other vias: 66.04,-45.72
N$835  (via drill 0.9)
  other vias: 63.5,-43.18
N$836  (via drill 0.9)
  other vias: 66.04,-43.18
N$837  (via drill 0.9)
  other vias: 63.5,-40.64
N$838  (via drill 0.9)
  other vias: 66.04,-40.64
N$839  (via drill 0.9)
  other vias: 63.5,-38.1
N$840  (via drill 0.9)
  other vias: 66.04,-38.1
N$841  (via drill 0.9)
  other vias: 63.5,-35.56
N$842  (via drill 0.9)
  other vias: 66.04,-35.56
N$843  (via drill 0.9)
  other vias: 63.5,-33.02
N$844  (via drill 0.9)
  other vias: 66.04,-33.02
N$845  (via drill 0.9)
  other vias: 63.5,-30.48
N$846  (via drill 0.9)
  other vias: 66.04,-30.48
N$847  (via drill 0.9)
  other vias: 68.58,2.54
N$848  (via drill 0.9)
  other vias: 71.12,2.54
N$849  (via drill 0.9)
  other vias: 71.12,5.08
N$850  (via drill 0.9)
  other vias: 68.58,5.08
N$851  (via drill 0.9)
  other vias: 68.58,7.62
N$852  (via drill 0.9)
  other vias: 71.12,7.62
N$853  (via drill 0.9)
  other vias: 68.58,10.16
N$854  (via drill 0.9)
  other vias: 71.12,10.16
N$855  (via drill 0.9)
  other vias: 68.58,12.7
N$856  (via drill 0.9)
  other vias: 71.12,12.7
N$857  (via drill 0.9)
  other vias: 68.58,15.24
N$858  (via drill 0.9)
  other vias: 71.12,15.24
N$859  (via drill 0.9)
  other vias: 68.58,17.78
N$860  (via drill 0.9)
  other vias: 71.12,17.78
N$861  (via drill 0.9)
  other vias: 68.58,20.32
N$862  (via drill 0.9)
  other vias: 71.12,20.32
N$863  (via drill 0.9)
  other vias: 68.58,22.86
N$864  (via drill 0.9)
  other vias: 71.12,22.86
N$865  (via drill 0.9)
  other vias: 68.58,25.4
N$866  (via drill 0.9)
  other vias: 71.12,25.4
N$867  (via drill 0.9)
  other vias: 68.58,27.94
N$868  (via drill 0.9)
  other vias: 71.12,27.94
N$869  (via drill 0.9)
  other vias: 68.58,30.48
N$870  (via drill 0.9)
  other vias: 71.12,30.48
N$871  (via drill 0.9)
  other vias: 68.58,-27.94
N$872  (via drill 0.9)
  other vias: 71.12,-27.94
N$873  (via drill 0.9)
  other vias: 71.12,-25.4
N$874  (via drill 0.9)
  other vias: 68.58,-25.4
N$875  (via drill 0.9)
  other vias: 68.58,-22.86
N$876  (via drill 0.9)
  other vias: 71.12,-22.86
N$877  (via drill 0.9)
  other vias: 68.58,-20.32
N$878  (via drill 0.9)
  other vias: 71.12,-20.32
N$879  (via drill 0.9)
  other vias: 68.58,-17.78
N$880  (via drill 0.9)
  other vias: 71.12,-17.78
N$881  (via drill 0.9)
  other vias: 68.58,-15.24
N$882  (via drill 0.9)
  other vias: 71.12,-15.24
N$883  (via drill 0.9)
  other vias: 68.58,-12.7
N$884  (via drill 0.9)
  other vias: 71.12,-12.7
N$885  (via drill 0.9)
  other vias: 68.58,-10.16 71.12,-10.16
N$886  (via drill 0.9)
  other vias: 68.58,-7.62
N$887  (via drill 0.9)
  other vias: 71.12,-7.62
N$888  (via drill 0.9)
  other vias: 68.58,-5.08
N$889  (via drill 0.9)
  other vias: 71.12,-5.08
N$890  (via drill 0.9)
  other vias: 68.58,-2.54
N$891  (via drill 0.9)
  other vias: 71.12,-2.54
N$892  (via drill 0.9)
  other vias: 68.58,0
N$893  (via drill 0.9)
  other vias: 71.12,0
N$894  (via drill 0.9)
  other vias: 68.58,-50.8
N$895  (via drill 0.9)
  other vias: 71.12,-50.8
N$896  (via drill 0.9)
  other vias: 68.58,-48.26
N$897  (via drill 0.9)
  other vias: 71.12,-48.26
N$898  (via drill 0.9)
  other vias: 68.58,-45.72
N$899  (via drill 0.9)
  other vias: 71.12,-45.72
N$900  (via drill 0.9)
  other vias: 68.58,-43.18
N$901  (via drill 0.9)
  other vias: 71.12,-43.18
N$902  (via drill 0.9)
  other vias: 68.58,-40.64
N$903  (via drill 0.9)
  other vias: 71.12,-40.64
N$904  (via drill 0.9)
  other vias: 68.58,-38.1
N$905  (via drill 0.9)
  other vias: 71.12,-38.1
N$906  (via drill 0.9)
  other vias: 68.58,-35.56
N$907  (via drill 0.9)
  other vias: 71.12,-35.56
N$908  (via drill 0.9)
  other vias: 68.58,-33.02
N$909  (via drill 0.9)
  other vias: 71.12,-33.02
N$910  (via drill 0.9)
  other vias: 68.58,-30.48
N$911  (via drill 0.9)
  other vias: 71.12,-30.48
N$912  (via drill 0.9)
  other vias: 73.66,2.54
N$913  (via drill 0.9)
  other vias: 73.66,5.08
N$914  (via drill 0.9)
  other vias: 73.66,7.62
N$915  (via drill 0.9)
  other vias: 73.66,10.16
N$916  (via drill 0.9)
  other vias: 73.66,12.7
N$917  (via drill 0.9)
  other vias: 73.66,15.24
N$918  (via drill 0.9)
  other vias: 73.66,17.78
N$919  (via drill 0.9)
  other vias: 73.66,20.32
N$920  (via drill 0.9)
  other vias: 73.66,22.86
N$921  (via drill 0.9)
  other vias: 73.66,25.4
N$922  (via drill 0.9)
  other vias: 73.66,27.94
N$923  (via drill 0.9)
  other vias: 73.66,30.48
N$924  (via drill 0.9)
  other vias: 73.66,-27.94
N$925  (via drill 0.9)
  other vias: 73.66,-25.4
N$926  (via drill 0.9)
  other vias: 73.66,-22.86
N$927  (via drill 0.9)
  other vias: 73.66,-20.32
N$928  (via drill 0.9)
  other vias: 73.66,-17.78
N$929  (via drill 0.9)
  other vias: 73.66,-15.24
N$930  (via drill 0.9)
  other vias: 73.66,-12.7
N$931  (via drill 0.9)
  other vias: 73.66,-10.16
N$932  (via drill 0.9)
  other vias: 73.66,-7.62
N$933  (via drill 0.9)
  other vias: 73.66,-5.08
N$934  (via drill 0.9)
  other vias: 73.66,-2.54
N$935  (via drill 0.9)
  other vias: 73.66,0
N$936  (via drill 0.9)
  other vias: 73.66,-50.8
N$937  (via drill 0.9)
  other vias: 73.66,-48.26
N$938  (via drill 0.9)
  other vias: 73.66,-45.72
N$939  (via drill 0.9)
  other vias: 73.66,-43.18
N$940  (via drill 0.9)
  other vias: 73.66,-40.64
N$941  (via drill 0.9)
  other vias: 73.66,-38.1
N$942  (via drill 0.9)
  other vias: 73.66,-35.56
N$943  (via drill 0.9)
  other vias: 73.66,-33.02
N$944  (via drill 0.9)
  other vias: 73.66,-30.48
N$945  (via drill 0.9)
  other vias: 76.2,2.54
N$946  (via drill 0.9)
  other vias: 78.74,2.54
N$947  (via drill 0.9)
  other vias: 78.74,5.08
N$948  (via drill 0.9)
  other vias: 76.2,5.08
N$949  (via drill 0.9)
  other vias: 76.2,7.62
N$950  (via drill 0.9)
  other vias: 78.74,7.62
N$951  (via drill 0.9)
  other vias: 76.2,10.16
N$952  (via drill 0.9)
  other vias: 78.74,10.16
N$953  (via drill 0.9)
  other vias: 76.2,12.7
N$954  (via drill 0.9)
  other vias: 78.74,12.7
N$955  (via drill 0.9)
  other vias: 76.2,15.24
N$956  (via drill 0.9)
  other vias: 78.74,15.24
N$957  (via drill 0.9)
  other vias: 76.2,17.78
N$958  (via drill 0.9)
  other vias: 78.74,17.78
N$959  (via drill 0.9)
  other vias: 76.2,20.32
N$960  (via drill 0.9)
  other vias: 78.74,20.32
N$961  (via drill 0.9)
  other vias: 76.2,22.86
N$962  (via drill 0.9)
  other vias: 78.74,22.86
N$963  (via drill 0.9)
  other vias: 76.2,25.4
N$964  (via drill 0.9)
  other vias: 78.74,25.4
N$965  (via drill 0.9)
  other vias: 76.2,27.94
N$966  (via drill 0.9)
  other vias: 78.74,27.94
N$967  (via drill 0.9)
  other vias: 76.2,30.48
N$968  (via drill 0.9)
  other vias: 78.74,30.48
N$969  (via drill 0.9)
  other vias: 76.2,-27.94
N$970  (via drill 0.9)
  other vias: 78.74,-27.94
N$971  (via drill 0.9)
  other vias: 78.74,-25.4
N$972  (via drill 0.9)
  other vias: 76.2,-25.4
N$973  (via drill 0.9)
  other vias: 76.2,-22.86
N$974  (via drill 0.9)
  other vias: 78.74,-22.86
N$975  (via drill 0.9)
  other vias: 76.2,-20.32
N$976  (via drill 0.9)
  other vias: 78.74,-20.32
N$977  (via drill 0.9)
  other vias: 76.2,-17.78
N$978  (via drill 0.9)
  other vias: 78.74,-17.78
N$979  (via drill 0.9)
  other vias: 76.2,-15.24
N$980  (via drill 0.9)
  other vias: 78.74,-15.24
N$981  (via drill 0.9)
  other vias: 76.2,-12.7
N$982  (via drill 0.9)
  other vias: 78.74,-12.7
N$983  (via drill 0.9)
  other vias: 76.2,-10.16
N$984  (via drill 0.9)
  other vias: 78.74,-10.16
N$985  (via drill 0.9)
  other vias: 76.2,-7.62
N$986  (via drill 0.9)
  other vias: 78.74,-7.62
N$987  (via drill 0.9)
  other vias: 76.2,-5.08
N$988  (via drill 0.9)
  other vias: 78.74,-5.08
N$989  (via drill 0.9)
  other vias: 76.2,-2.54
N$990  (via drill 0.9)
  other vias: 78.74,-2.54
N$991  (via drill 0.9)
  other vias: 76.2,0
N$992  (via drill 0.9)
  other vias: 78.74,0
N$993  (via drill 0.9)
  other vias: 76.2,-50.8
N$994  (via drill 0.9)
  other vias: 78.74,-50.8
N$995  (via drill 0.9)
  other vias: 76.2,-48.26
N$996  (via drill 0.9)
  other vias: 78.74,-48.26
N$997  (via drill 0.9)
  other vias: 76.2,-45.72
N$998  (via drill 0.9)
  other vias: 78.74,-45.72
N$999  (via drill 0.9)
  other vias: 76.2,-43.18
N$1000  (via drill 0.9)
  other vias: 78.74,-43.18
N$1001  (via drill 0.9)
  other vias: 76.2,-40.64
N$1002  (via drill 0.9)
  other vias: 78.74,-40.64
N$1003  (via drill 0.9)
  other vias: 76.2,-38.1
N$1004  (via drill 0.9)
  other vias: 78.74,-38.1
N$1005  (via drill 0.9)
  other vias: 76.2,-35.56
N$1006  (via drill 0.9)
  other vias: 78.74,-35.56
N$1007  (via drill 0.9)
  other vias: 76.2,-33.02
N$1008  (via drill 0.9)
  other vias: 78.74,-33.02
N$1009  (via drill 0.9)
  other vias: 76.2,-30.48
N$1010  (via drill 0.9)
  other vias: 78.74,-30.48
N$1011  (via drill 0.9)
  other vias: 81.28,2.54
N$1012  (via drill 0.9)
  other vias: 83.82,2.54
N$1013  (via drill 0.9)
  other vias: 83.82,5.08
N$1014  (via drill 0.9)
  other vias: 81.28,5.08
N$1015  (via drill 0.9)
  other vias: 81.28,7.62
N$1016  (via drill 0.9)
  other vias: 83.82,7.62
N$1017  (via drill 0.9)
  other vias: 81.28,10.16
N$1018  (via drill 0.9)
  other vias: 83.82,10.16
N$1019  (via drill 0.9)
  other vias: 81.28,12.7
N$1020  (via drill 0.9)
  other vias: 83.82,12.7
N$1021  (via drill 0.9)
  other vias: 81.28,15.24
N$1022  (via drill 0.9)
  other vias: 83.82,15.24